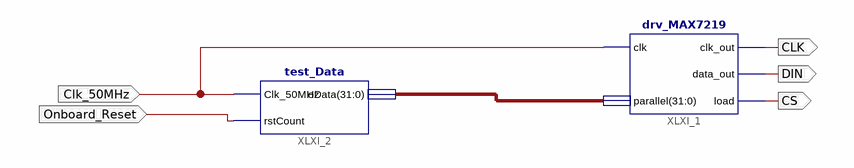
[diagram p0: schematic sheet 1]
// Xilinx ISE schematic adas.sch (spartan6) as structural Verilog: 2 symbols, 5 ports
module adas (
  input  Clk_50MHz,
  input  Onboard_Reset,
  output CLK,
  output DIN,
  output CS
);

  wire [31:0] XLXN_1;

  drv_MAX7219 XLXI_1 (.clk(Clk_50MHz), .parallel(XLXN_1), .clk_out(CLK), .data_out(DIN), .load(CS));
  test_Data XLXI_2 (.Clk_50MHz(Clk_50MHz), .rstCount(Onboard_Reset), .oData(XLXN_1));
endmodule
